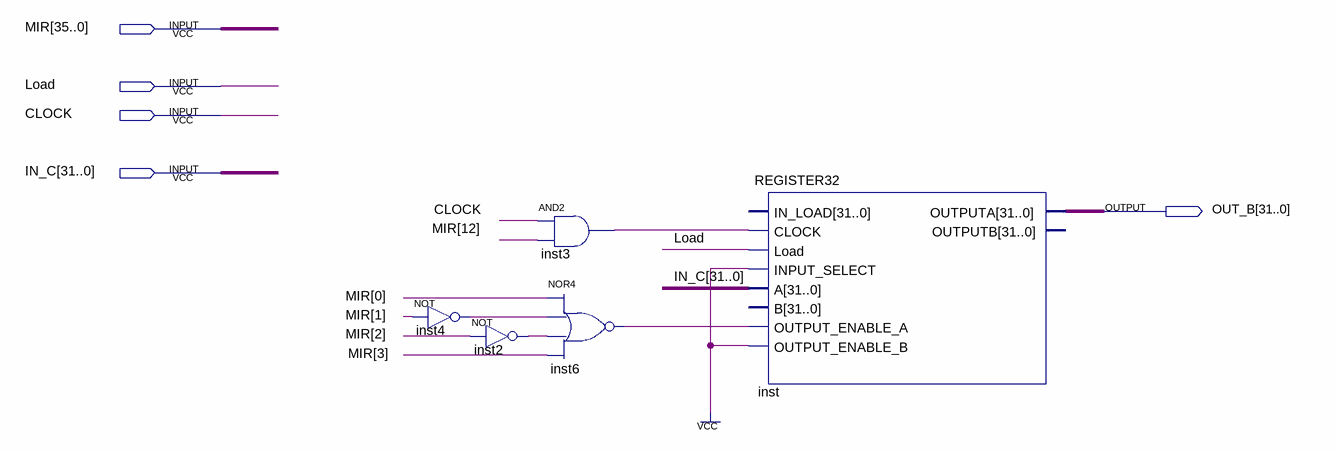
[diagram p0: schematic sheet]
// Quartus schematic CPP.bdf as structural Verilog: 5 symbols, 5 pins
module CPP (
  input  [35:0] MIR,
  input  Load,
  input  CLOCK,
  input  [31:0] IN_C,
  output [31:0] OUT_B
);

  wire inst2_out, inst3_out, inst4_out, inst6_out;

  not inst4 (inst4_out, MIR[1]);
  not inst2 (inst2_out, MIR[2]);
  and inst3 (inst3_out, CLOCK, MIR[12]);
  nor inst6 (inst6_out, MIR[0], inst4_out, inst2_out, MIR[3]);
  REGISTER32 inst (
    .CLOCK(inst3_out), .Load(Load), .INPUT_SELECT(1'b1), .A(IN_C), .OUTPUT_ENABLE_A(inst6_out),
    .OUTPUT_ENABLE_B(1'b1), .OUTPUTA(OUT_B));  // open: IN_LOAD, B, OUTPUTB
endmodule
